# EAGLE design throughHoleAdapter (EAGLE 6.5.0)
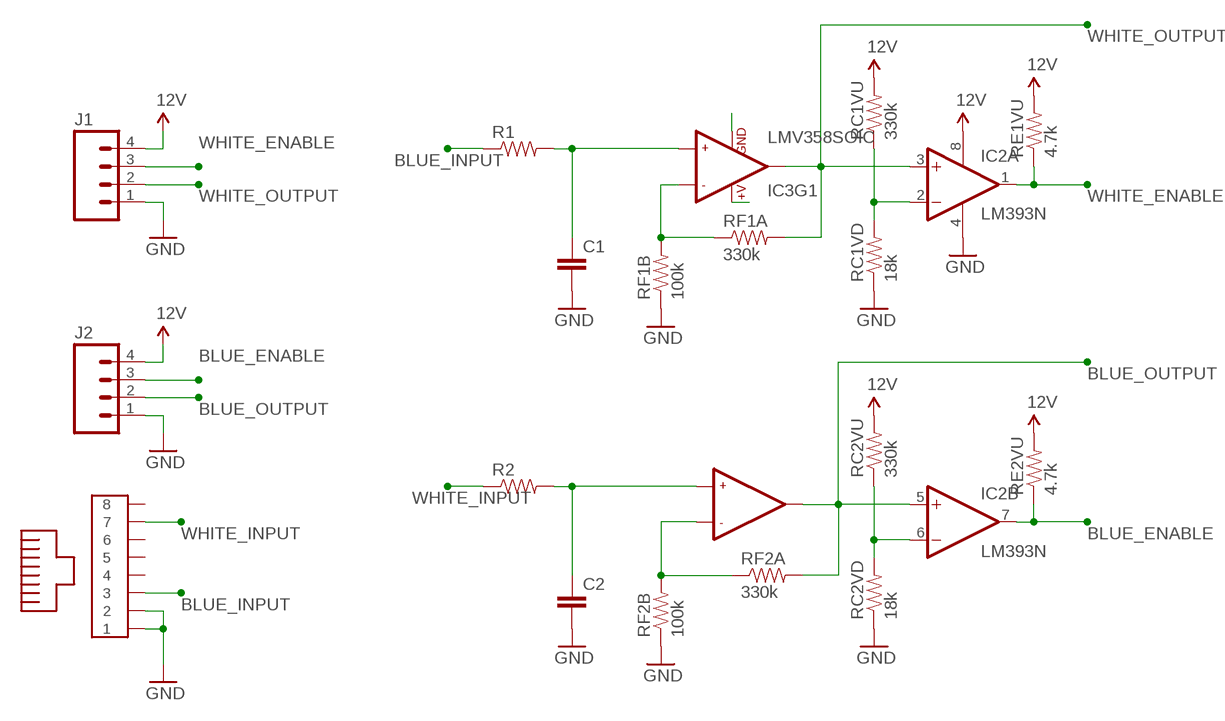
[diagram p0: schematic, sheet 1]

## Parts
C1  CAPKIT  [CAP-PTH-SMALL-KIT]
C2  CAPKIT  [CAP-PTH-SMALL-KIT]
IC2  LM393N  [DIL08]
IC3  LMV358SOIC  [SO08]
J1  M04LONGPADS  [1X04_LONGPADS]
J2  M04LONGPADS  [1X04_LONGPADS]
R1  RESISTOR1206  [1206]
R2  RESISTOR1206  [1206]
RC1VD  18k  RESISTOR1206  [1206]
RC1VU  330k  RESISTOR1206  [1206]
RC2VD  18k  RESISTOR1206  [1206]
RC2VU  330k  RESISTOR1206  [1206]
RE1VU  4.7k  RESISTOR1206  [1206]
RE2VU  4.7k  RESISTOR1206  [1206]
RF1A  330k  RESISTOR1206  [1206]
RF1B  100k  RESISTOR1206  [1206]
RF2A  330k  RESISTOR1206  [1206]
RF2B  100k  RESISTOR1206  [1206]
U$1  MOLEX-RJ45-SMT  [MOLEX-RJ45-SMT]

## Nets
12V: IC2.8(P:V+) IC3.8(+V) J1.4 J2.4 RC1VU.2 RC2VU.2 RE1VU.2 RE2VU.2
BLUE_ENABLE: IC2.7(B:OUT) J2.3 RE2VU.1
BLUE_INPUT: R1.1 U$1.3
BLUE_OUTPUT: IC2.5(B:+IN) IC3.7(OUT2) J2.2 RF2A.2
GND: C1.2 C2.2 IC2.4(P:V-) IC3.4(GND) J1.1 J2.1 RC1VD.1 RC2VD.1 RF1B.1 RF2B.1 U$1.1 U$1.2
N$4: IC3.2(-IN1) RF1A.1 RF1B.2
N$5: IC2.6(B:-IN) RC2VD.2 RC2VU.1
N$6: IC3.6(-IN2) RF2A.1 RF2B.2
N$7: C1.1 IC3.3(+IN1) R1.2
N$8: C2.1 IC3.5(+IN2) R2.2
N$9: IC2.2(A:-IN) RC1VD.2 RC1VU.1
WHITE_ENABLE: IC2.1(A:OUT) J1.3 RE1VU.1
WHITE_INPUT: R2.1 U$1.7
WHITE_OUTPUT: IC2.3(A:+IN) IC3.1(OUT1) J1.2 RF1A.2
Unconnected: U$1.4 U$1.5 U$1.6 U$1.8

## Library data of the parts
C1 C2 = SparkFun-Capacitors:CAP: Capacitor Standard 0603 ceramic capacitor, and 0.1" leaded capacitor.
IC2 = linear:LM393: COMPARATOR
IC3 = SparkFun-AnalogIC:LMV358: Jellybean rail-to-rail output op-amp; PROD_ID: IC-09657
J1 J2 = SparkFun-Connectors:M04: Header 4 Standard 4-pin 0.1" header. Use with straight break away headers (SKU : PRT-00116), right angle break away headers (PRT-00553), swiss pins (PRT-00743), machine pins (PRT-00117), and female headers (PRT-00115). Molex polarized connector foot print use with SKU : PRT-08231 with associated crimp pins and housings. 1MM SMD Version SKU: PRT-10208; PROD_ID: CONN-09696
R1 R2 RC1VD RC1VU RC2VD RC2VU RE1VU RE2VU RF1A RF1B RF2A RF2B = SparkFun-Resistors:RESISTOR: Resistor Basic schematic elements and footprints for 0603, 1206, and PTH resistors.
U$1 = SMD-RJ45:MOLEX-RJ45-SMT

## Board
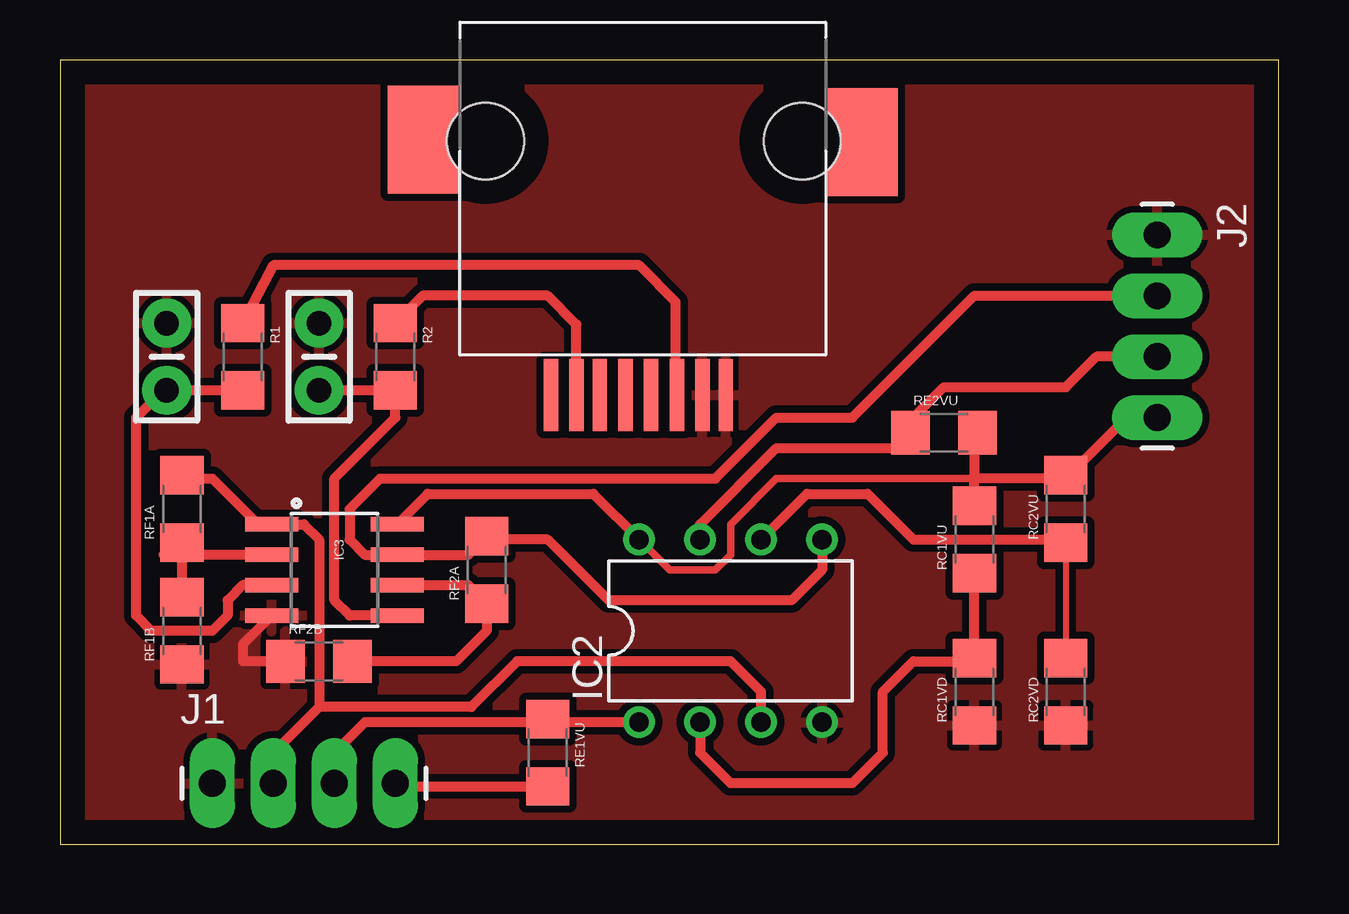
[diagram p1: board, top side]
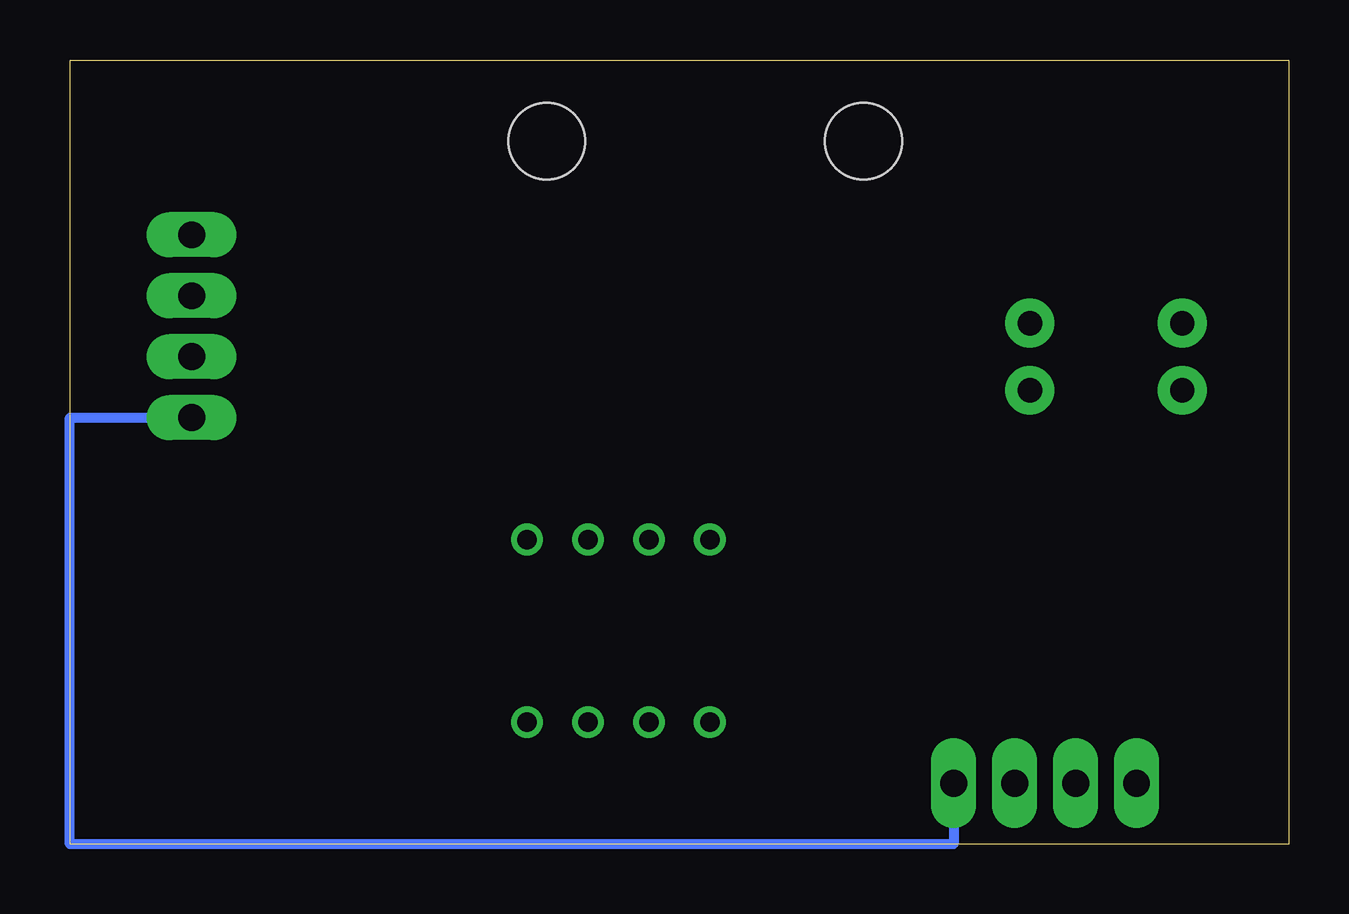
[diagram p2: board, bottom side, seen from below]

Size 50.78 x 32.69 mm. Coordinates in mm from the lower left corner, seen from the top.
Outline: 0,0 50.78,0 50.78,32.69 0,32.69 0,0
Copper layers (1*16): Top 0.035mm / dielectric 1.5mm / Bottom 0.035mm
Design rules "default": minimum track width 10mil, minimum drill 24mil, track to track 8mil, track to pad 8mil, pad to pad 8mil, via to via 8mil, smd to smd 8mil, copper to edge 40mil, drill to drill 8mil, minimum pad ring 10mil, minimum via ring 8mil, stop-mask expansion 4mil, vias tented up to drill 0mil, thermal gap 10mil

### Footprints (pad centres in the part's own frame; a part is rotated, then mirrored left to right if it is on the bottom)
CAP-PTH-SMALL-KIT = drill 1.016 pad 2.032: 1 -1.397,0; 2 1.397,0
DIL08 = drill 0.813 pad 1.27: 1 -3.81,-3.81; 2 -1.27,-3.81; 3 1.27,-3.81; 4 3.81,-3.81; 5 3.81,3.81; 6 1.27,3.81; 7 -1.27,3.81; 8 -3.81,3.81
SO08 = smd 0.61 x 2.21: 1 -1.905,-2.616; 2 -0.635,-2.616; 3 0.635,-2.616; 4 1.905,-2.616; 5 1.905,2.616; 6 0.635,2.616; 7 -0.635,2.616; 8 -1.905,2.616
1X04_LONGPADS = drill 1.118 pad 1.88 long: 1 0,0; 2 2.54,0; 3 5.08,0; 4 7.62,0
1206 = smd 1.6 x 1.8: 1 -1.4,0; 2 1.4,0
MOLEX-RJ45-SMT = smd 3 x 0.6: 1 10.48,3.61; 2 10.48,2.64; 3 10.48,1.57; 4 10.48,0.5; 5 10.48,-0.57; 6 10.48,-1.64; 7 10.48,-2.61; 8 10.48,-3.68 | smd 4.5 x 3: P$1 -0.16,-8.97; P$2 -0.06,9.28 | hole 3.2: -0.1,6.8; -0.1,-6.4

### Placement (x,y rotation side)
C1  4.45,20.32 90 top
C2  10.79,20.32 90 top
IC2  27.94,8.89 0 top
IC3  11.43,11.43 270 top
J1  6.35,2.54 0 top
J2  45.72,25.4 270 top
R1  7.62,20.32 270 top
R2  13.97,20.32 270 top
RC1VD  38.1,6.35 90 top
RC1VU  38.1,12.7 90 top
RC2VD  41.91,6.35 90 top
RC2VU  41.91,13.97 90 top
RE1VU  20.32,3.81 270 top
RE2VU  36.83,17.14 0 top
RF1A  5.08,13.97 90 top
RF1B  5.08,8.89 90 top
RF2A  17.78,11.43 90 top
RF2B  10.79,7.62 0 top
U$1  24.13,29.21 270 top

### Tracks (layer width: path | path; a pad name or v marks a point on that pad's centre or on a via)
12V
  Top 0.305: IC2.8 25.4,11.43 27.3,11.43 27.94,12.06 27.94,13.34 29.84,15.24 38.1,15.24
  Top 0.406: IC3.8 15.32,14.61 22.23,14.61 IC2.8 | RC1VU.2 38.1,15.24 | J2.4 44.45,17.78 42.04,15.37 RC2VU.2 41.78,15.24 38.1,15.24 | J1.4 14.1,2.41 RE1VU.2 | RE2VU.2 38.1,17.02 38.1,15.24
  Bottom 0.406: J2.4 50.8,17.78 50.8,0 13.97,0 J1.4
BLUE_ENABLE
  Top 0.406: J2.3 43.18,20.32 41.91,19.05 36.83,19.05 35.56,17.78 35.56,17.27 RE2VU.1 35.43,16.64 35.56,16.51 29.84,16.51 26.67,13.34 IC2.7
BLUE_INPUT
  Top 0.406: R1.1 8.89,24.13 24.13,24.13 25.65,22.61 25.65,18.78 U$1.3
BLUE_OUTPUT
  Top 0.406: IC2.5 31.75,11.43 30.48,10.16 22.86,10.16 20.32,12.7 17.91,12.7 RF2A.2 17.02,12.06 IC3.7 12.7,12.06 12.06,12.7 12.06,13.97 13.34,15.24 27.3,15.24 29.84,17.78 33.02,17.78 38.1,22.86 J2.2
GND
  Top 0.406: IC3.4 7.62,8.33 7.62,7.62 RF2B.1
  pour Top (isolate 0.305): 0,33.02 50.8,33.02 50.8,0 0,0
N$4
  Top 0.406: 5.08,12.06 RF1A.1 4.32,12.06 | 5.08,12.06 RF1B.2 | IC3.2 5.08,12.06
N$5
  Top 0.254: RC2VD.2 RC2VU.1 41.91,12.7
  Top 0.406: IC2.6 31.11,14.61 33.66,14.61 35.56,12.7 41.78,12.7 RC2VU.1
N$6
  Top 0.406: IC3.6 17.02,10.79 RF2A.1 17.78,8.89 16.51,7.62 RF2B.2
N$7
  Top 0.406: R1.2 6.35,18.92 C1.1 4.32,18.92 3.17,17.78 3.17,9.53 3.81,8.89 6.35,8.89 6.99,9.53 6.99,10.16 7.62,10.79 IC3.3
N$8
  Top 0.406: C2.1 R2.2 13.97,17.78 11.43,15.24 11.43,10.16 12.06,9.53 IC3.5
N$9
  Top 0.406: RC1VU.1 RC1VD.2 37.97,7.62 35.56,7.62 34.29,6.35 34.29,3.81 33.02,2.54 27.94,2.54 26.67,3.81 IC2.2
WHITE_ENABLE
  Top 0.406: J1.3 11.43,3.81 12.7,5.08 20.19,5.08 RE1VU.1 20.32,5.08 IC2.1
WHITE_INPUT
  Top 0.406: R2.1 15.11,22.86 20.32,22.86 21.52,21.66 U$1.7
WHITE_OUTPUT
  Top 0.406: IC2.3 29.21,6.35 27.94,7.62 19.05,7.62 17.14,5.71 10.79,5.71 | RF1A.2 5.21,15.24 6.35,15.24 8.26,13.34 IC3.1 10.16,13.34 10.79,12.7 10.79,5.71 | J1.2 8.89,3.81 10.79,5.71